# Altium schematic sheet BMS Carrier - Current Sense Interface.SchDoc: Current Sense isoSPI Interface
size B; Revision: 2.1; Website: www.uwmidsun.com
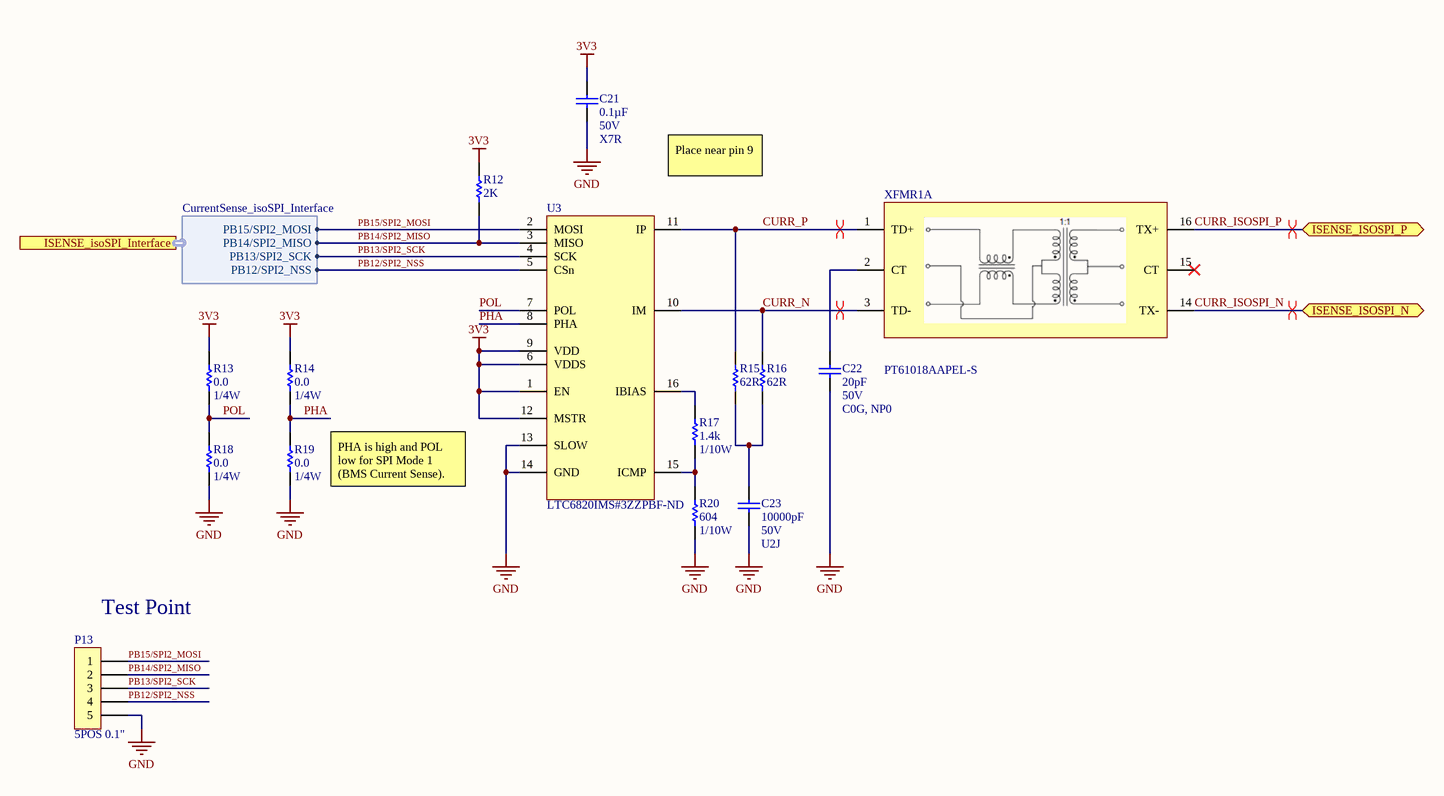
[diagram p0: BMS Carrier - Current Sense Interface.SchDoc]

## Parts
C21  Capacitance: 0.1µF  Voltage: 50V  Temperature Coefficient: X7R  [CAP, 0603]  (hidden comment: CAP CER 0.1UF 50V 10% X7R 0603)
C22  Capacitance: 20pF  Voltage: 50V  Temperature Coefficient: C0G, NP0  [CAP, 0603]  (hidden comment: CAP CER 20PF 50V ±5% C0G/NP0 0603)
C23  Capacitance: 10000pF  Voltage: 50V  Temperature Coefficient: U2J  [CAP, 0603]  (hidden comment: CAP CER 10nF 50V 5% X7R 0603)
P13  5POS 0.1"  [CONN, 5POS HEADR 0.1"]
R12  2K  [RES, 0603]
R13  Resistance: 0.0  Power (Watts): 1/4W  [RES, 0603]  (hidden comment: RES 0.0 OHM 1/4W 0603)
R14  Resistance: 0.0  Power (Watts): 1/4W  [RES, 0603]  (hidden comment: RES 0.0 OHM 1/4W 0603)
R15  62R  [RES, 0603]
R16  62R  [RES, 0603]
R17  Resistance: 1.4k  Power: 1/10W  [RES, 0603]  (hidden comment: RES 1.4k OHM 1% 1/10W 0603)
R18  Resistance: 0.0  Power (Watts): 1/4W  [RES, 0603]  (hidden comment: RES 0.0 OHM 1/4W 0603)
R19  Resistance: 0.0  Power (Watts): 1/4W  [RES, 0603]  (hidden comment: RES 0.0 OHM 1/4W 0603)
R20  Resistance: 604  Power: 1/10W  [RES, 0603]  (hidden comment: RES 604 OHM 1% 1/10W 0603)
U3  Supplier Part Number 1: LTC6820IMS#3ZZPBF-ND  [IC isoSPI Interface LTC6820 MSOP]  (hidden comment: IC ISOSPI COMM INTERFACE LTC6820IMS#3ZZPBF)
XFMR1  MFG_PN: PT61018AAPEL-S  [IC, PULSE XFMR 1CT:1CT 350UH SMD]  (hidden comment: IC PULSE XFMR 1CT:1CT 350UH SMD)  (part A of 2)

## Ports
ISENSE_isoSPI_Interface (harness CurrentSense_isoSPI_Interface), ISENSE_ISOSPI_N (bidir), ISENSE_ISOSPI_P (bidir)

## Harnesses
CurrentSense_isoSPI_Interface: PB15/SPI2_MOSI, PB14/SPI2_MISO, PB13/SPI2_SCK, PB12/SPI2_NSS

## Nets
3V3: C21.1 R12.1 R13.1 R14.1 U3.1(EN) U3.6(VDDS) U3.9(VDD) U3.12(MSTR)
GND: C21.2 C22.2 C23.2 P13.5 R18.2 R19.2 R20.2 U3.13(SLOW) U3.14(GND)
CURR_ISOSPI_N: XFMR1.14(TX-) ; port ISENSE_ISOSPI_N
CURR_ISOSPI_P: XFMR1.16(TX+) ; port ISENSE_ISOSPI_P
CURR_N: R16.1 U3.10(IM) XFMR1.3(TD-)
CURR_P: R15.1 U3.11(IP) XFMR1.1(TD+)
PB12/SPI2_NSS: P13.4 U3.5(CSn) ; port ISENSE_isoSPI_Interface.PB12/SPI2_NSS
PB13/SPI2_SCK: P13.3 U3.4(SCK) ; port ISENSE_isoSPI_Interface.PB13/SPI2_SCK
PB14/SPI2_MISO: P13.2 R12.2 U3.3(MISO) ; port ISENSE_isoSPI_Interface.PB14/SPI2_MISO
PB15/SPI2_MOSI: P13.1 U3.2(MOSI) ; port ISENSE_isoSPI_Interface.PB15/SPI2_MOSI
PHA: R14.2 R19.1 U3.8(PHA)
POL: R13.2 R18.1 U3.7(POL)
NetC22_1: C22.1 XFMR1.2(CT)
NetC23_1: C23.1 R15.2 R16.2
NetR17_1: R17.1 U3.16(IBIAS)
NetR17_2: R17.2 R20.1 U3.15(ICMP)

Not connected (* = marked no-connect by the designer): XFMR1 15(CT)*

## Layout directives
differential pair: CURR_ISOSPI_N, CURR_ISOSPI_P, CURR_N, CURR_P

## Notes on the sheet
- Place near pin 9
- PHA is high and POL low for SPI Mode 1 (BMS Current Sense).
- (near P13) Test Point
- PROJECT
- DOCUMENT
- DRAWN BY
- LAST MODIFIED
- PART NUMBER
- REVISION
- SHEET
- VARIANT
- OF
- Engineering 5 - 1002
  University of Waterloo
  (519) 888-4567 x32978
  hardware@uwmidsun.com

## Library data of the parts
C21 = CAP CER 0.1UF 50V 10% X7R 0603: 0.10µF ±10% 50V Ceramic Capacitor X7R 0603 (1608 Metric); Manufacturer 1: AVX Corporation; Manufacturer Part Number 1: 06035C104KAT2A; Supplier 1: Digi-Key; Supplier Part Number 1: 478-5052-1-ND; Packaging: Cut Tape (CT); Part Status: Active; Operating Temperature: -55°C ~ 125°C; Ratings: -; Mounting Type: Surface Mount, MLCC; Package / Case: 0603 (1608 Metric); Size / Dimension: 0.063" L x 0.032" W (1.60mm x 0.81mm); Height - Seated (Max): -; Thickness (Max): 0.035" (0.90mm); Lead Spacing: -; Lead Style: -; ComponentLink1URL: http://datasheets.avx.com/X7RDielectric.pdf; ComponentLink1Description: http://datasheets.avx.com/X7RDielectric.pdf; Tolerance: ±10%
C22 = CAP CER 20PF 50V ±5% C0G/NP0 0603: 20pF ±5% 50V Ceramic Capacitor C0G, NP0 0603 (1608 Metric); Manufacturer 1: Murata Electronics North America; Manufacturer Part Number 1: GRM1885C1H200JA01D; Supplier 1: Digi-Key; Supplier Part Number 1: 490-1410-1-ND; Packaging: Cut Tape (CT); Part Status: Active; Operating Temperature: -55°C ~ 125°C; Ratings: -; Mounting Type: Surface Mount, MLCC; Package / Case: 0603 (1608 Metric); Size / Dimension: 0.063" L x 0.031" W (1.60mm x 0.80mm); Height - Seated (Max): -; Thickness (Max): 0.035" (0.90mm); Lead Spacing: -; Lead Style: -; ComponentLink1URL: http://www.murata.com/~/media/webrenewal/support/library/catalog/products/capacitor/mlcc/c02e.ashx; ComponentLink1Description: http://www.murata.com/~/media/webrenewal/support/library/catalog/products/capacitor/mlcc/c02e.ashx; Tolerance: ±5%
C23 = CAP CER 10nF 50V 5% X7R 0603: 10000pF ±5% 50V Ceramic Capacitor U2J 0603 (1608 Metric); Manufacturer 1: KEMET; Manufacturer Part Number 1: C0603C103J5JAC7867; Supplier 1: Digi-Key; Supplier Part Number 1: 399-13384-1-ND; Packaging: Cut Tape (CT); Part Status: Active; Operating Temperature: -55°C ~ 125°C; Ratings: -; Failure Rate: -; Mounting Type: Surface Mount, MLCC; Package / Case: 0603 (1608 Metric); Size / Dimension: 0.063" L x 0.032" W (1.60mm x 0.80mm); Height - Seated (Max): -; Thickness (Max): 0.034" (0.87mm); Lead Spacing: -; Lead Style: -; ComponentLink1URL: http://www.kemet.com/docfinder?Partnumber=C0603C103J5JAC7867; ComponentLink1Description: http://www.kemet.com/docfinder?Partnumber=C0603C103J5JAC7867; Tolerance: ±5%
P13 = CONN 5POS HEADR MALE 0.1": Manufacturer 1: Molex; Manufacturer Part Number 1: 0022284050; Description 1: Conn Unshrouded Header HDR 5 POS 2.54mm Solder ST Thru-Hole KK® Bag; Contact Resistance: 20mR; Number of Positions: 5; Gender: Male; Connector Type: Male Pin; Max Voltage Rating (AC): 250V; Pitch: 2.54mm; Supplier 1: Digi-Key; Supplier Part Number 1: WM50014-05-ND; Stock 1: 3161; Pricing 1: 1=0.22, 10=0.21, 25=0.1796, 50=0.157, 100=0.1459, 250=0.129, 500=0.1234 (USD); Mount: Through Hole; Colour: Black; Contact Plating: Nickel,Tin; Contact Material: Bronze,Brass; Housing Colour: Black; Housing Material: Nylon; Min Operating Temperature: 0°C; Max Operating Temperature: 75°C; Packaging: Bulk; Number of Rows: 1; Termination: Solder; Number of Contacts: 5; Orientation: Straight; Max Voltage Rating (DC): 250V; Length: 12.7mm; Depth: 2.49mm; Contact Mating Length: 0.24inch; ComponentLink1URL: https://datasheet.ciiva.com/6814/022284363-sd-6814049.pdf; ComponentLink1Description: https://datasheet.ciiva.com/6814/022284363-sd-6814049.pdf; ComponentLink2URL: https://datasheet.ciiva.com/14804/179390022284050-pcb-headers-14804361.pdf; ComponentLink2Description: https://datasheet.ciiva.com/14804/179390022284050-pcb-headers-14804361.pdf; ComponentLink3URL: https://datasheet.ciiva.com/15217/getdatasheetpartid-256138-15217709.pdf; ComponentLink3Description: https://datasheet.ciiva.com/15217/getdatasheetpartid-256138-15217709.pdf
R12 = RES 2K OHM 1% 1/10W 0603: 2k Ohm ±1% 0.1W, 1/10W Chip Resistor 0603 (1608 Metric) Moisture Resistant Thick Film; Manufacturer: Yageo; Manufacturer Part Number: RC0603FR-072KL; Temperature Coefficient: ±100ppm/°C; Supplier 1: Digi-Key; RoHS: RoHS Compliant; Category: Resistors; Stock 1: 1750701; Pricing 1: 1=0.15, 10=0.023, 100=0.0093, 1000=0.00415, 2500=0.0036 (CAD); Packaging: Cut Tape (CT); Part Status: Active; Resistance (Ohms): 2k; Tolerance: ±1%; Power (Watts): 0.1W, 1/10W; Composition: Thick Film; Features: Moisture Resistant; Operating Temperature: -55°C ~ 155°C; Package / Case: 0603 (1608 Metric); Supplier Device Package: 0603; Size / Dimension: 0.063" L x 0.031" W (1.60mm x 0.80mm); Height - Seated (Max): 0.022" (0.55mm); Failure Rate: -; ComponentLink1URL: http://www.yageo.com/documents/recent/PYu-RC_Group_51_RoHS_L_7.pdf; ComponentLink1Description: http://www.yageo.com/documents/recent/PYu-RC_Group_51_RoHS_L_7.pdf; Supplier Part Number 1: 311-2.00KHRCT-ND
R13 R14 R18 R19 = RES 0.0 OHM 1/4W 0603: RES SMD 0.0 OHM JUMPER 1/4W 0603; Manufacturer 1: Vishay Dale; Manufacturer Part Number 1: CRCW06030000Z0EAHP; Supplier 1: Digi-Key; Supplier Part Number 1: 541-0.0SBCT-ND; Packaging: Cut Tape (CT); Part Status: Active; Composition: Thick Film; Operating Temperature: -55°C ~ 155°C; Package / Case: 0603 (1608 Metric); Supplier Device Package: 0603; Size / Dimension: 0.063" L x 0.033" W (1.60mm x 0.85mm); Height - Seated (Max): 0.022" (0.55mm); Failure Rate: -; ComponentLink1URL: http://www.vishay.com/docs/20043/crcwhpe3.pdf; ComponentLink1Description: http://www.vishay.com/docs/20043/crcwhpe3.pdf
R15 R16 = RES 62 OHM 0.1% 1/10W 0603: 62 Ohms ±0.1% 0.1W, 1/10W Chip Resistor 0603 (1608 Metric) Automotive AEC-Q200 Thin Film; Manufacturer: Panasonic Electronic Components; Manufacturer Part Number: ERA-3AEB620V; Temperature Coefficient: ±25ppm/°C; Supplier 1: Digi-Key; RoHS: RoHS Compliant; Category: Resistors; Stock 1: 10320; Pricing 1: 1=0.52, 10=0.447, 100=0.1748, 1000=0.07317, 2500=0.06708 (CAD); Packaging: Cut Tape (CT); Part Status: Active; Tolerance: ±0.1%; Power (Watts): 0.1W, 1/10W; Composition: Thin Film; Features: Automotive AEC-Q200; Operating Temperature: -55°C ~ 155°C; Package / Case: 0603 (1608 Metric); Supplier Device Package: 0603; Size / Dimension: 0.063" L x 0.032" W (1.60mm x 0.80mm); Height - Seated (Max): 0.022" (0.55mm); Failure Rate: -; ComponentLink1URL: https://industrial.panasonic.com/cdbs/www-data/pdf/RDM0000/AOA0000C307.pdf; ComponentLink1Description: https://industrial.panasonic.com/cdbs/www-data/pdf/RDM0000/AOA0000C307.pdf; Supplier Part Number 1: P62DBCT-ND
R17 = RES 1.4k OHM 1% 1/10W 0603: RES SMD 1.4K OHM 1% 1/10W 0603; Manufacturer 1: Yageo; Manufacturer Part Number 1: RC0603FR-071K4L; Temperature Coefficient: ±100ppm/°C; Supplier 1: Digi-Key; Supplier Part Number 1: 311-1.40KHRCT-ND; Packaging: Cut Tape (CT); Part Status: Active; Composition: Thick Film; Operating Temperature: -55°C ~ 155°C; Package / Case: 0603 (1608 Metric); Supplier Device Package: 0603; Size / Dimension: 0.063" L x 0.031" W (1.60mm x 0.80mm); Height - Seated (Max): 0.022" (0.55mm); Failure Rate: -; ComponentLink1URL: http://www.yageo.com/documents/recent/PYu-RC_Group_51_RoHS_L_7.pdf; ComponentLink1Description: http://www.yageo.com/documents/recent/PYu-RC_Group_51_RoHS_L_7.pdf; Tolerance: ±1%
R20 = RES 604 OHM 1% 1/10W 0603: RES SMD 604 OHM 1% 1/10W 0603; Manufacturer 1: Yageo; Manufacturer Part Number 1: RC0603FR-07604RL; Temperature Coefficient: ±100ppm/°C; Supplier 1: Digi-Key; Supplier Part Number 1: 311-604HRCT-ND; Packaging: Cut Tape (CT); Part Status: Active; Composition: Thick Film; Operating Temperature: -55°C ~ 155°C; Package / Case: 0603 (1608 Metric); Supplier Device Package: 0603; Size / Dimension: 0.063" L x 0.031" W (1.60mm x 0.80mm); Height - Seated (Max): 0.022" (0.55mm); Failure Rate: -; ComponentLink1URL: http://www.yageo.com/documents/recent/PYu-RC_Group_51_RoHS_L_7.pdf; ComponentLink1Description: http://www.yageo.com/documents/recent/PYu-RC_Group_51_RoHS_L_7.pdf; Tolerance: ±1%
U3 = IC ISOSPI COMM INTERFACE LTC6820IMS#3ZZPBF: IC COMM INTERFACE ISOSPI 16-MSOP; Manufacturer: Linear Technology; Interface: SPI; Voltage - Supply: 2.7 V ~ 5.5 V; Manufacturer Part Number: LTC6820IMS#3ZZPBF; RoHS: RoHS Compliant; Category: Integrated Circuits (ICs); Packaging: Tube; Part Status: Active; Applications: Isolated Communications Interface; Package / Case: 16-Lead Plastic MSOP; Supplier Device Package: 16-Lead Plastic MSOP; Mounting Type: Surface Mount; ComponentLink1URL: http://www.linear.com/docs/42317; ComponentLink1Description: http://www.linear.com/docs/42317; Supplier 1: Digi-Key
XFMR1 = IC PULSE XFMR 1CT:1CT 350UH SMD: PULSE XFMR 1CT:1CT 350UH SMD; Manufacturer: Bourns Inc.; Isolation Voltage: 1.5kVrms; Supplier: Digikey; Supplier_PN: PT61018AAPEL-SCT-ND; Inductance: 350uH; Supplier 1: Digi-Key; Supplier Part Number 1: PT61018AAPEL-SCT-ND